# EAGLE design qo-100-psu-interface (EAGLE 9.6.2)
CREVISION: 1; DESIGNER: Joao Silva
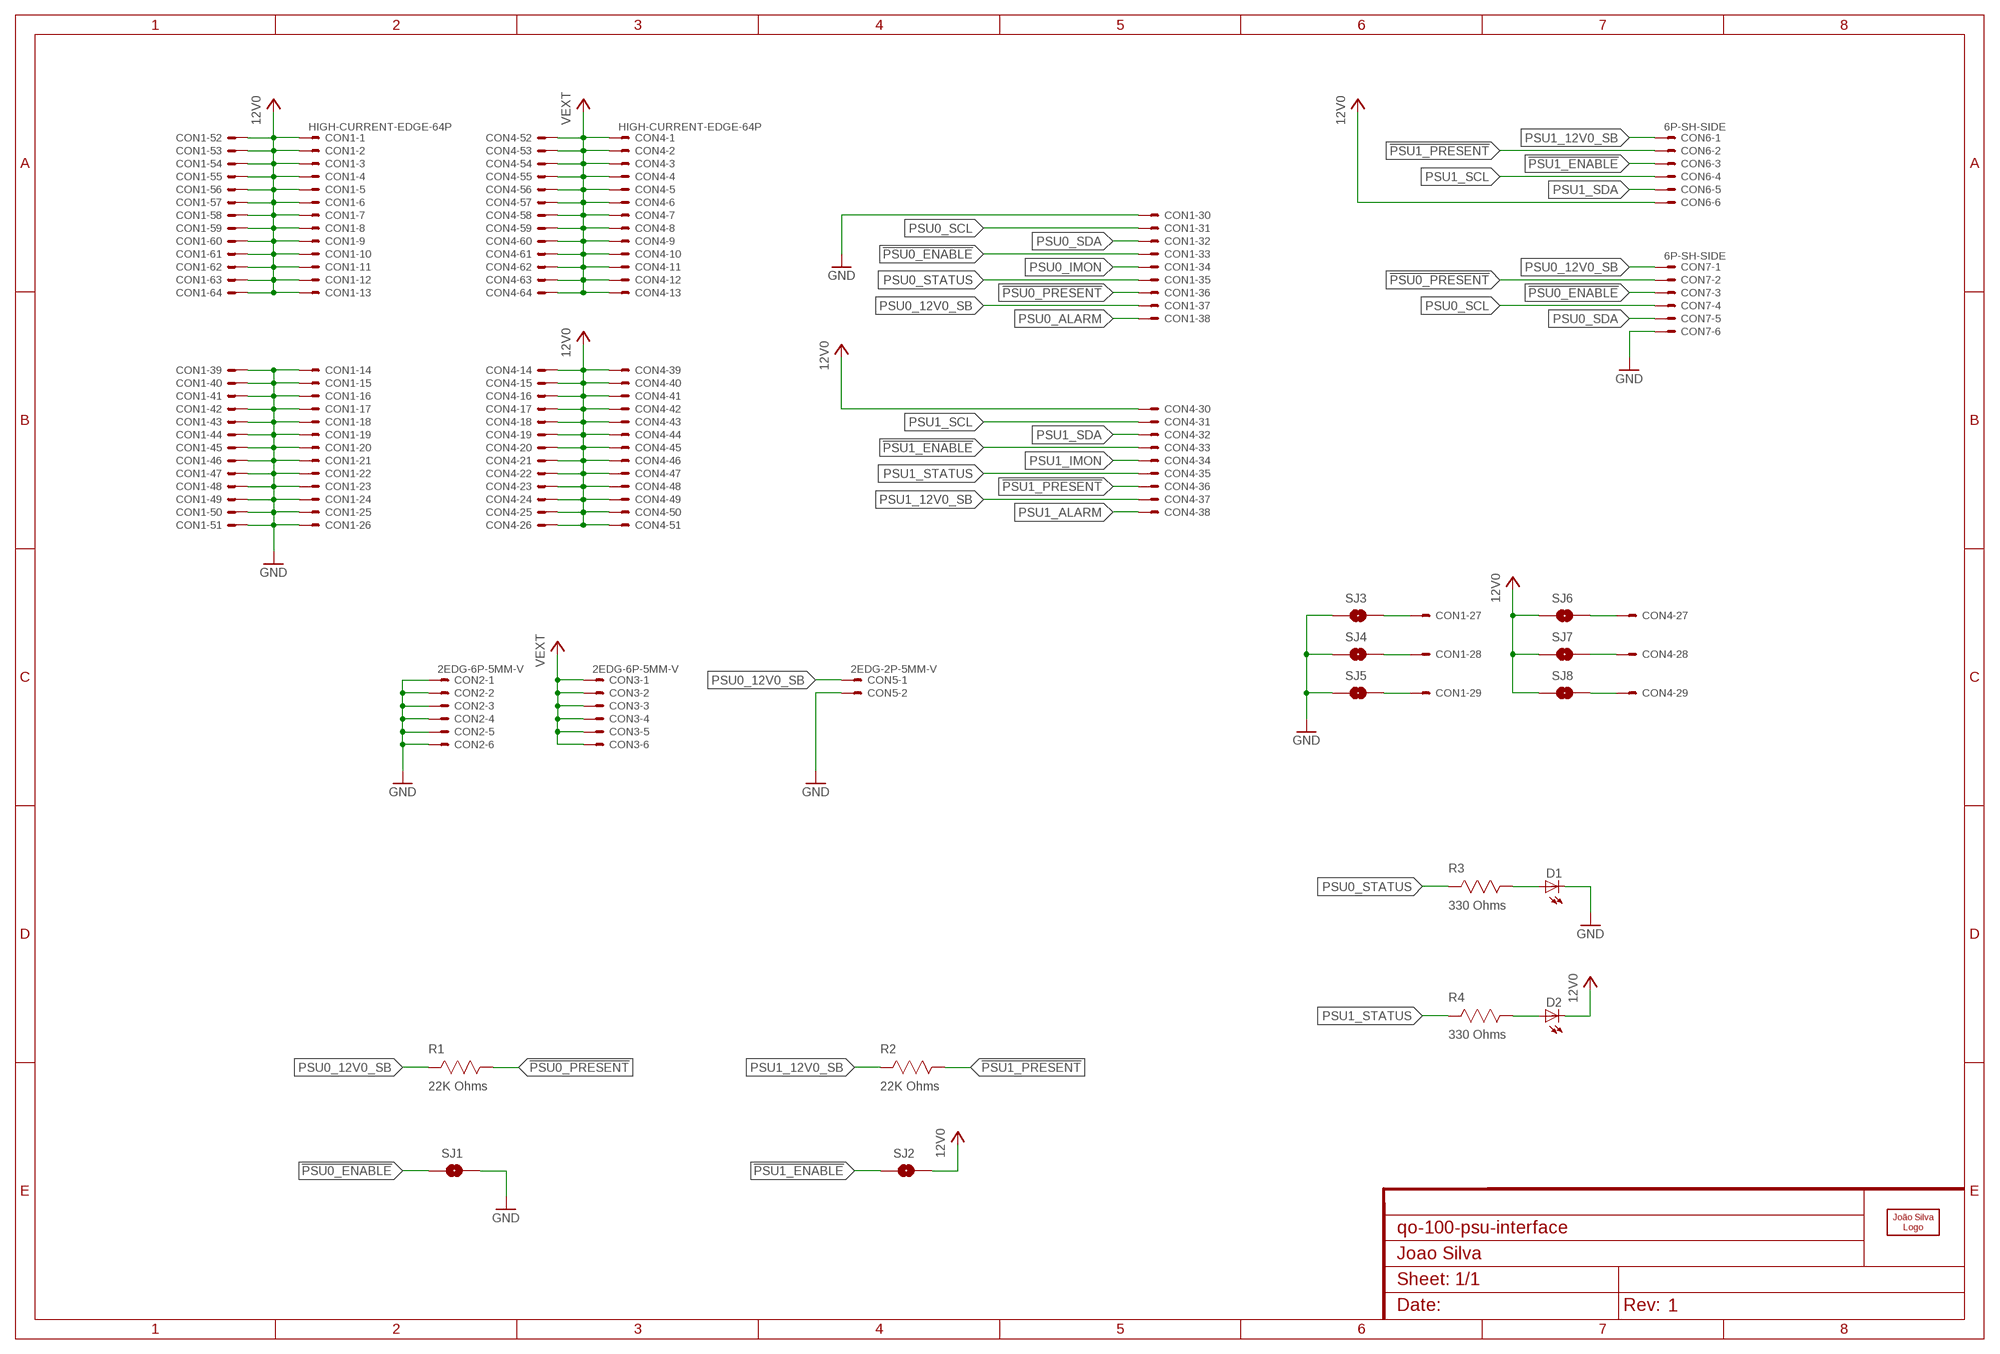
[diagram p0: schematic, sheet 1]

## Parts
CON1  HIGH-CURRENT-EDGE-64P  [HIGH-CURRENT-EDGE-64P]
CON2  2EDG-6P-5MM-V  [2EDG-6P-5MM-V]
CON3  2EDG-6P-5MM-V  [2EDG-6P-5MM-V]
CON4  HIGH-CURRENT-EDGE-64P  [HIGH-CURRENT-EDGE-64P]
CON5  2EDG-2P-5MM-V  [2EDG-2P-5MM-V]
CON6  6P-SH-SIDE  [SH-06-SIDE]
CON7  6P-SH-SIDE  [SH-06-SIDE]
D1  LED0603  [0603]
D2  LED0603  [0603]
LOGO1  JS-5MM  [JS_5MM]
R1  22K Ohms  RESISTOR-0603  [RES0603]
R2  22K Ohms  RESISTOR-0603  [RES0603]
R3  330 Ohms  RESISTOR-0603  [RES0603]
R4  330 Ohms  RESISTOR-0603  [RES0603]
SJ1  SJS  [SJ_S]
SJ2  SJS  [SJ_S]
SJ3  SJS  [SJ_S]
SJ4  SJS  [SJ_S]
SJ5  SJS  [SJ_S]
SJ6  SJS  [SJ_S]
SJ7  SJS  [SJ_S]
SJ8  SJS  [SJ_S]

## Nets
12V0: CON1.1 CON1.2 CON1.3 CON1.4 CON1.5 CON1.6 CON1.7 CON1.8 CON1.9 CON1.10 CON1.11 CON1.12 CON1.13 CON1.52 CON1.53 CON1.54 CON1.55 CON1.56 CON1.57 CON1.58 CON1.59 CON1.60 CON1.61 CON1.62 CON1.63 CON1.64 CON4.14 CON4.15 CON4.16 CON4.17 CON4.18 CON4.19 CON4.20 CON4.21 CON4.22 CON4.23 CON4.24 CON4.25 CON4.26 CON4.30 CON4.39 CON4.40 CON4.41 CON4.42 CON4.43 CON4.44 CON4.45 CON4.46 CON4.47 CON4.48 CON4.49 CON4.50 CON4.51 CON6.6 D2.C SJ2.2 SJ6.1 SJ7.1 SJ8.1
!PSU0_ENABLE: CON1.33 CON7.3 SJ1.1
!PSU0_PRESENT: CON1.36 CON7.2 R1.1
!PSU1_ENABLE: CON4.33 CON6.3 SJ2.1
!PSU1_PRESENT: CON4.36 CON6.2 R2.1
GND: CON1.14 CON1.15 CON1.16 CON1.17 CON1.18 CON1.19 CON1.20 CON1.21 CON1.22 CON1.23 CON1.24 CON1.25 CON1.26 CON1.30 CON1.39 CON1.40 CON1.41 CON1.42 CON1.43 CON1.44 CON1.45 CON1.46 CON1.47 CON1.48 CON1.49 CON1.50 CON1.51 CON2.P$1 CON2.P$2 CON2.P$3 CON2.P$4 CON2.P$5 CON2.P$6 CON5.P$2 CON7.6 D1.C SJ1.2 SJ3.1 SJ4.1 SJ5.1
N$1: CON1.29 SJ5.2
N$2: CON1.28 SJ4.2
N$3: CON1.27 SJ3.2
N$4: CON4.27 SJ6.2
N$5: CON4.28 SJ7.2
N$6: CON4.29 SJ8.2
N$7: D1.A R3.1
N$8: D2.A R4.1
PSU0_12V0_SB: CON1.37 CON5.P$1 CON7.1 R1.2
PSU0_ALARM: CON1.38
PSU0_IMON: CON1.34
PSU0_SCL: CON1.31 CON7.4
PSU0_SDA: CON1.32 CON7.5
PSU0_STATUS: CON1.35 R3.2
PSU1_12V0_SB: CON4.37 CON6.1 R2.2
PSU1_ALARM: CON4.38
PSU1_IMON: CON4.34
PSU1_SCL: CON4.31 CON6.4
PSU1_SDA: CON4.32 CON6.5
PSU1_STATUS: CON4.35 R4.2
VEXT: CON3.P$1 CON3.P$2 CON3.P$3 CON3.P$4 CON3.P$5 CON3.P$6 CON4.1 CON4.2 CON4.3 CON4.4 CON4.5 CON4.6 CON4.7 CON4.8 CON4.9 CON4.10 CON4.11 CON4.12 CON4.13 CON4.52 CON4.53 CON4.54 CON4.55 CON4.56 CON4.57 CON4.58 CON4.59 CON4.60 CON4.61 CON4.62 CON4.63 CON4.64

## Library data of the parts
CON1 CON4 = Generic Connector:HIGH-CURRENT-EDGE-64P
CON2 CON3 = Generic Connector:2EDG-6P
CON5 = Generic Connector:2EDG-2P
CON6 CON7 = JST:6P: Disconnectable Crimp style connector, 1.0mm pitch 6 contacts
D1 D2 = LED:LED
LOGO1 = Silkscreen:JS
R1-R4 = Resistor:RESISTOR
SJ1-SJ8 = Solder Jumper:SJ

## Board
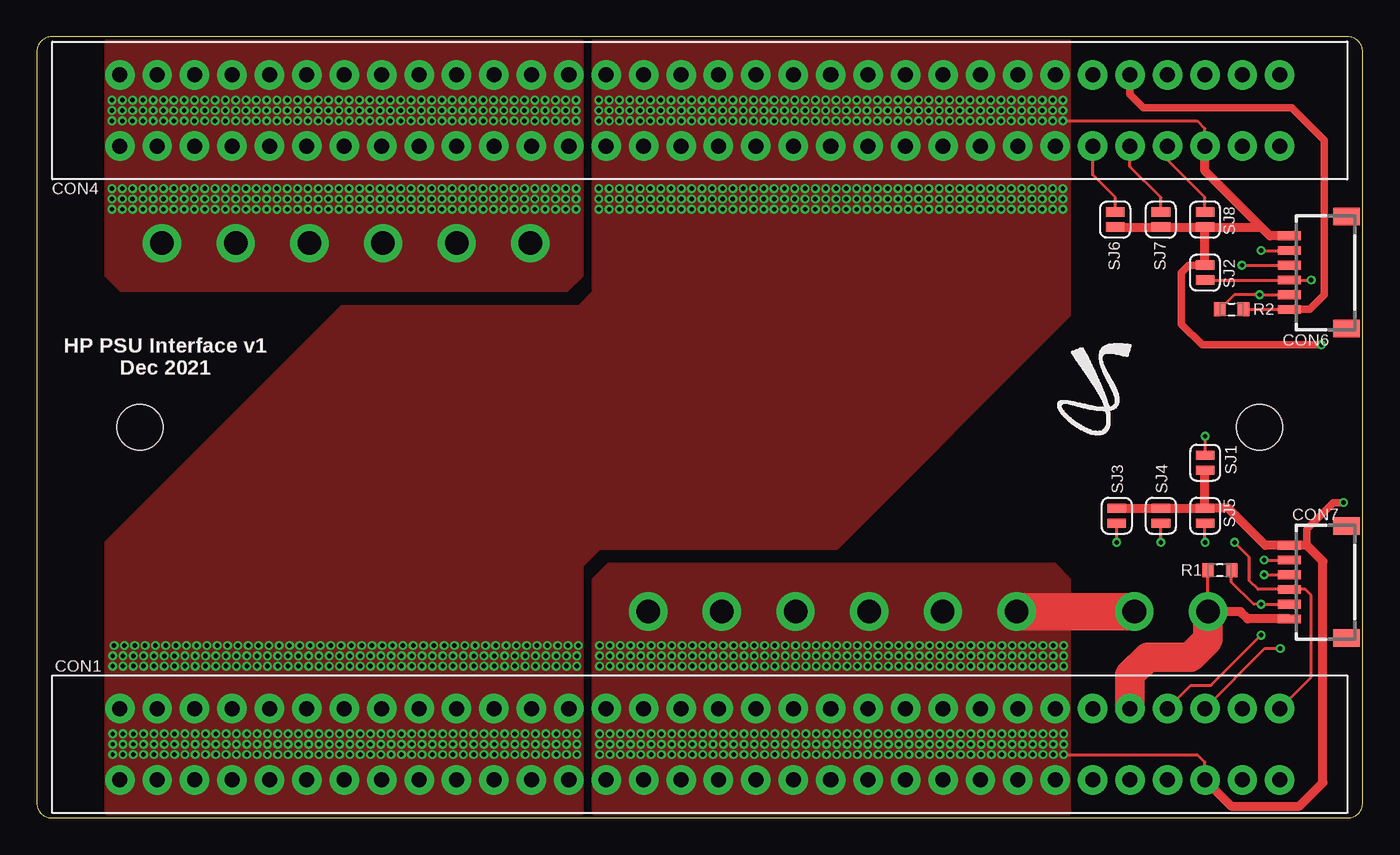
[diagram p1: board, top side]
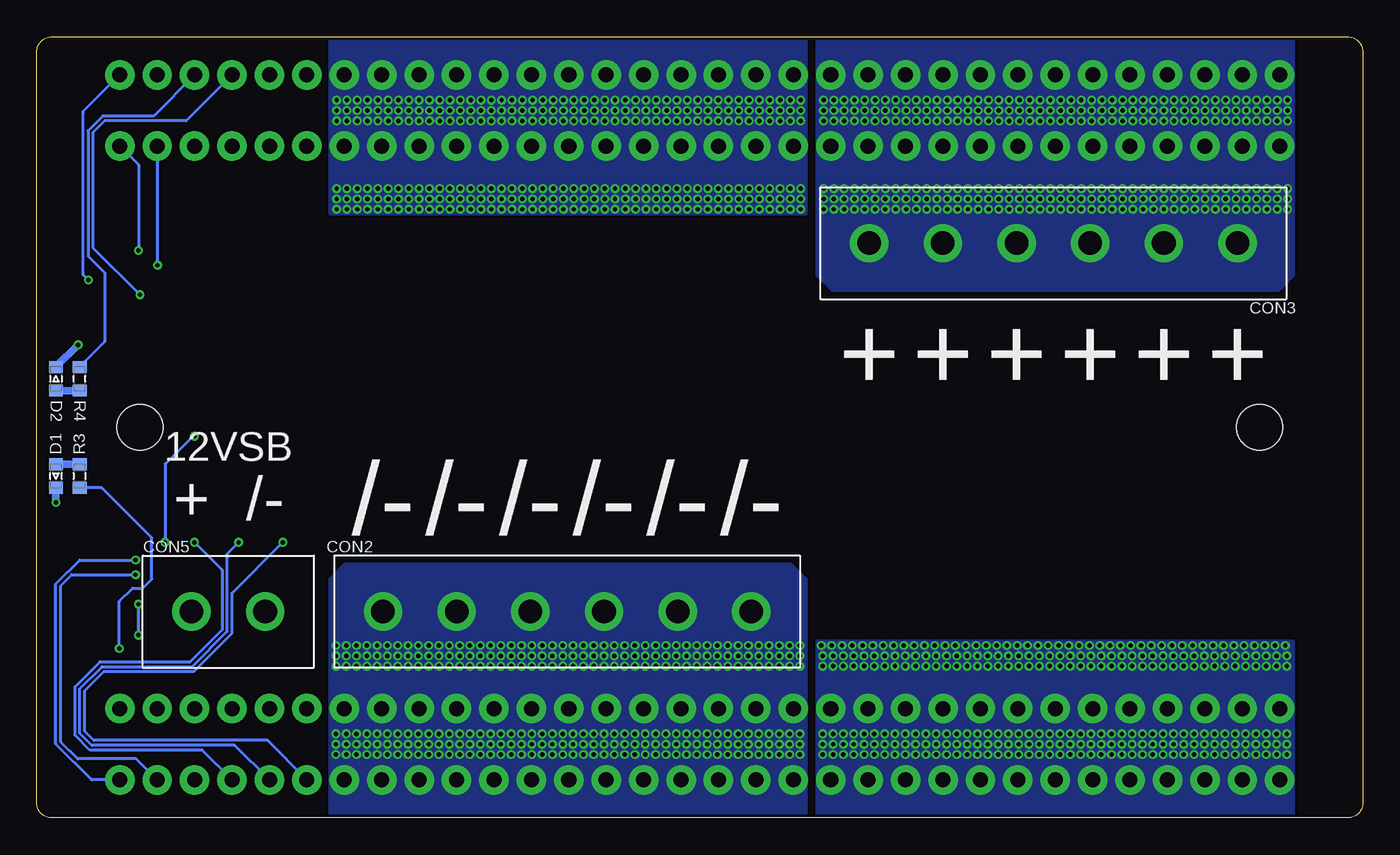
[diagram p2: board, bottom side, seen from below]

Size 90 x 53 mm. Coordinates in mm from the lower left corner, seen from the top.
Outline: 89,53 1,53 arc90 0,52 0,1 arc90 1,0 89,0 arc90 90,1 90,52 arc90 89,53
Copper layers (1*16): Top 0.035mm / dielectric 1.6mm / Bottom 0.035mm
Design rules "jlcpcb_2layer": minimum track width 5mil, minimum drill 0.3mm, track to track 5mil, track to pad 5mil, pad to pad 5mil, via to via 5mil, smd to smd 5mil, copper to edge 0.2mm, drill to drill 5mil, minimum pad ring 0.13mm, minimum via ring 0.1mm, stop-mask expansion 0.04mm, vias tented up to drill 10mm, thermal gap 5mil
Holes 3.1 mm at 7,26.5 83,26.5

### Footprints (pad centres in the part's own frame; a part is rotated, then mirrored left to right if it is on the bottom)
HIGH-CURRENT-EDGE-64P = drill 1.02 pad 2: 1 -39.37,-2.42; 2 -36.83,-2.42; 3 -34.29,-2.42; 4 -31.75,-2.42; 5 -29.21,-2.42; 6 -26.67,-2.42; 7 -24.13,-2.42; 8 -21.59,-2.42; 9 -19.05,-2.42; 10 -16.51,-2.42; 11 -13.97,-2.42; 12 -11.43,-2.42; 13 -8.89,-2.42; 14 -6.35,-2.42; 15 -3.81,-2.42; 16 -1.27,-2.42; 17 1.27,-2.42; 18 3.81,-2.42; 19 6.35,-2.42; 20 8.89,-2.42; 21 11.43,-2.42; 22 13.97,-2.42; 23 16.51,-2.42; 24 19.05,-2.42; 25 21.59,-2.42; 26 24.13,-2.42; 27 26.67,-2.42; 28 29.21,-2.42; 29 31.75,-2.42; 30 34.29,-2.42; 31 36.83,-2.42; 32 39.37,-2.42; 33 39.37,2.42; 34 36.83,2.42; 35 34.29,2.42; 36 31.75,2.42; 37 29.21,2.42; 38 26.67,2.42; 39 24.13,2.42; 40 21.59,2.42; 41 19.05,2.42; 42 16.51,2.42; 43 13.97,2.42; 44 11.43,2.42; 45 8.89,2.42; 46 6.35,2.42; 47 3.81,2.42; 48 1.27,2.42; 49 -1.27,2.42; 50 -3.81,2.42; 51 -6.35,2.42; 52 -8.89,2.42; 53 -11.43,2.42; 54 -13.97,2.42; 55 -16.51,2.42; 56 -19.05,2.42; 57 -21.59,2.42; 58 -24.13,2.42; 59 -26.67,2.42; 60 -29.21,2.42; 61 -31.75,2.42; 62 -34.29,2.42; 63 -36.83,2.42; 64 -39.37,2.42
2EDG-6P-5MM-V = drill 1.6 pad 2.6: P$1 -12.5,0; P$2 -7.5,0; P$3 -2.5,0; P$4 2.5,0; P$5 7.5,0; P$6 12.5,0
2EDG-2P-5MM-V = drill 1.6 pad 2.6: P$1 -2.5,0; P$2 2.5,0
SH-06-SIDE = smd 0.6 x 1.55: 1 -2.5,2.975; 2 -1.5,2.975; 3 -0.5,2.975; 4 0.5,2.975; 5 1.5,2.975; 6 2.5,2.975 | smd 1.2 x 1.8: FIT@1 -3.8,-0.9; FIT@2 3.8,-0.9
0603 = smd 0.8 x 0.95: A 0.8,0; C -0.8,0
RES0603 = smd 0.8 x 0.95: 1 -0.8,0; 2 0.8,0
SJ_S = smd 0.635 x 1.27: 1 -0.508,0; 2 0.508,0

### Placement (x,y rotation side)
CON1  45,5 0 top
CON2  54,14 180 bottom
CON3  21,39 0 bottom
CON4  45,48 0 top
CON5  77,14 0 bottom
CON6  88,37 90 top
CON7  88,16 90 top
D1  88.7,23.2 90 bottom
D2  88.7,29.8 270 bottom
LOGO1  74.5,32.4 0 top
R1  80.3,16.8 180 top
R2  81.1,34.5 0 top
R3  87.1,23.2 270 bottom
R4  87.1,29.8 90 bottom
SJ1  79.3,24.1 270 top
SJ2  79.3,37 90 top
SJ3  73.3,20.5 270 top
SJ4  76.3,20.5 270 top
SJ5  79.3,20.5 270 top
SJ6  73.2,40.6 90 top
SJ7  76.3,40.6 90 top
SJ8  79.3,40.6 90 top

### Tracks (layer width: path | path; a pad name or v marks a point on that pad's centre or on a via)
12V0  (via drill 0.3)
  Top 0.2: CON4.30 79.29,46.78 78.77,47.3 v69.65,47.3
  Top 0.508: v87.2,32.1 79.1,32.1 77.7,33.5 77.7,37 78.21,37.51 SJ2.2
  Top 0.61: SJ6.1 SJ7.1 SJ8.1 | SJ8.1 83.11,40.09 | 83.11,40.09 83.7,39.5 CON6.6 | 83.11,40.09 79.29,43.91 CON4.30 | SJ2.2 SJ8.1
  Bottom 0.508: D2.C v87.2,32.1
  other vias: 38.85,41.3 38.15,41.3 38.15,42 38.15,42.7 38.85,42.7 38.85,42 40.25,41.3 39.55,41.3 39.55,42 39.55,42.7 40.25,42.7 40.25,42 41.65,41.3 40.95,41.3 40.95,42 40.95,42.7 41.65,42.7 41.65,42 43.05,41.3 42.35,41.3 42.35,42 42.35,42.7 43.05,42.7 43.05,42 44.45,41.3 43.75,41.3 43.75,42 43.75,42.7 44.45,42.7 44.45,42 45.85,41.3 45.15,41.3 45.15,42 45.15,42.7 45.85,42.7 45.85,42 47.25,41.3 46.55,41.3 46.55,42 46.55,42.7 47.25,42.7 47.25,42 68.25,41.3 67.55,41.3 67.55,42 67.55,42.7 68.25,42.7 68.25,42 69.65,41.3 68.95,41.3 68.95,42 68.95,42.7 69.65,42.7 69.65,42 58.45,41.3 57.75,41.3 57.75,42 57.75,42.7 58.45,42.7 58.45,42 59.85,41.3 59.15,41.3 59.15,42 59.15,42.7 59.85,42.7 59.85,42 61.25,41.3 60.55,41.3 60.55,42 60.55,42.7 61.25,42.7 61.25,42 62.65,41.3 61.95,41.3 61.95,42 61.95,42.7 62.65,42.7 62.65,42 64.05,41.3 63.35,41.3 63.35,42 63.35,42.7 64.05,42.7 64.05,42 65.45,41.3 64.75,41.3 64.75,42 64.75,42.7 65.45,42.7 65.45,42 66.85,41.3 66.15,41.3 66.15,42 66.15,42.7 66.85,42.7 66.85,42 48.65,41.3 47.95,41.3 47.95,42 47.95,42.7 48.65,42.7 48.65,42 50.05,41.3 49.35,41.3 49.35,42 49.35,42.7 50.05,42.7 50.05,42 51.45,41.3 50.75,41.3 50.75,42 50.75,42.7 51.45,42.7 51.45,42 52.85,41.3 52.15,41.3 52.15,42 52.15,42.7 52.85,42.7 52.85,42 54.25,41.3 53.55,41.3 53.55,42 53.55,42.7 54.25,42.7 54.25,42 55.65,41.3 54.95,41.3 54.95,42 54.95,42.7 55.65,42.7 55.65,42 57.05,41.3 56.35,41.3 56.35,42 56.35,42.7 57.05,42.7 57.05,42 5.85,10.3 5.15,10.3 5.15,11 5.25,11.7 5.95,11.7 5.85,11 7.25,10.3 6.55,10.3 6.55,11 6.65,11.7 7.35,11.7 7.25,11 8.65,10.3 7.95,10.3 7.95,11 8.05,11.7 8.75,11.7 8.65,11 10.05,10.3 9.35,10.3 9.35,11 9.45,11.7 10.15,11.7 10.05,11 11.45,10.3 10.75,10.3 10.75,11 10.85,11.7 11.55,11.7 11.45,11 12.85,10.3 12.15,10.3 12.15,11 12.25,11.7 12.95,11.7 12.85,11 14.25,10.3 13.55,10.3 13.55,11 13.65,11.7 14.35,11.7 14.25,11 35.25,10.3 34.55,10.3 34.55,11 34.65,11.7 35.35,11.7 35.25,11 36.65,10.3 35.95,10.3 35.95,11 36.05,11.7 36.75,11.7 36.65,11 25.45,10.3 24.75,10.3 24.75,11 24.85,11.7 25.55,11.7 25.45,11 26.85,10.3 26.15,10.3 26.15,11 26.25,11.7 26.95,11.7 26.85,11 28.25,10.3 27.55,10.3 27.55,11 27.65,11.7 28.35,11.7 28.25,11 29.65,10.3 28.95,10.3 28.95,11 29.05,11.7 29.75,11.7 29.65,11 31.05,10.3 30.35,10.3 30.35,11 30.45,11.7 31.15,11.7 31.05,11 32.45,10.3 31.75,10.3 31.75,11 31.85,11.7 32.55,11.7 32.45,11 33.85,10.3 33.15,10.3 33.15,11 33.25,11.7 33.95,11.7 33.85,11 15.65,10.3 14.95,10.3 14.95,11 15.05,11.7 15.75,11.7 15.65,11 17.05,10.3 16.35,10.3 16.35,11 16.45,11.7 17.15,11.7 17.05,11 18.45,10.3 17.75,10.3 17.75,11 17.85,11.7 18.55,11.7 18.45,11 19.85,10.3 19.15,10.3 19.15,11 19.25,11.7 19.95,11.7 19.85,11 21.25,10.3 20.55,10.3 20.55,11 20.65,11.7 21.35,11.7 21.25,11 22.65,10.3 21.95,10.3 21.95,11 22.05,11.7 22.75,11.7 22.65,11 24.05,10.3 23.35,10.3 23.35,11 23.45,11.7 24.15,11.7 24.05,11 5.85,4.3 5.15,4.3 5.15,5 5.15,5.7 5.85,5.7 5.85,5 7.25,4.3 6.55,4.3 6.55,5 6.55,5.7 7.25,5.7 7.25,5 8.65,4.3 7.95,4.3 7.95,5 7.95,5.7 8.65,5.7 8.65,5 10.05,4.3 9.35,4.3 9.35,5 9.35,5.7 10.05,5.7 10.05,5 11.45,4.3 10.75,4.3 10.75,5 10.75,5.7 11.45,5.7 11.45,5 12.85,4.3 12.15,4.3 12.15,5 12.15,5.7 12.85,5.7 12.85,5 14.25,4.3 13.55,4.3 13.55,5 13.55,5.7 14.25,5.7 14.25,5 35.25,4.3 34.55,4.3 34.55,5 34.55,5.7 35.25,5.7 35.25,5 36.65,4.3 35.95,4.3 35.95,5 35.95,5.7 36.65,5.7 36.65,5 25.45,4.3 24.75,4.3 24.75,5 24.75,5.7 25.45,5.7 25.45,5 26.85,4.3 26.15,4.3 26.15,5 26.15,5.7 26.85,5.7 26.85,5 28.25,4.3 27.55,4.3 27.55,5 27.55,5.7 28.25,5.7 28.25,5 29.65,4.3 28.95,4.3 28.95,5 28.95,5.7 29.65,5.7 29.65,5 31.05,4.3 30.35,4.3 30.35,5 30.35,5.7 31.05,5.7 31.05,5 32.45,4.3 31.75,4.3 31.75,5 31.75,5.7 32.45,5.7 32.45,5 33.85,4.3 33.15,4.3 33.15,5 33.15,5.7 33.85,5.7 33.85,5 15.65,4.3 14.95,4.3 14.95,5 14.95,5.7 15.65,5.7 15.65,5 17.05,4.3 16.35,4.3 16.35,5 16.35,5.7 17.05,5.7 17.05,5 18.45,4.3 17.75,4.3 17.75,5 17.75,5.7 18.45,5.7 18.45,5 19.85,4.3 19.15,4.3 19.15,5 19.15,5.7 19.85,5.7 19.85,5 21.25,4.3 20.55,4.3 20.55,5 20.55,5.7 21.25,5.7 21.25,5 22.65,4.3 21.95,4.3 21.95,5 21.95,5.7 22.65,5.7 22.65,5 24.05,4.3 23.35,4.3 23.35,5 23.35,5.7 24.05,5.7 24.05,5 38.85,47.3 38.15,47.3 38.15,48 38.15,48.7 38.85,48.7 38.85,48 40.25,47.3 39.55,47.3 39.55,48 39.55,48.7 40.25,48.7 40.25,48 41.65,47.3 40.95,47.3 40.95,48 40.95,48.7 41.65,48.7 41.65,48 43.05,47.3 42.35,47.3 42.35,48 42.35,48.7 43.05,48.7 43.05,48 44.45,47.3 43.75,47.3 43.75,48 43.75,48.7 44.45,48.7 44.45,48 45.85,47.3 45.15,47.3 45.15,48 45.15,48.7 45.85,48.7 45.85,48 47.25,47.3 46.55,47.3 46.55,48 46.55,48.7 47.25,48.7 47.25,48 68.25,47.3 67.55,47.3 67.55,48 67.55,48.7 68.25,48.7 68.25,48 68.95,47.3 68.95,48 68.95,48.7 69.65,48.7 69.65,48 58.45,47.3 57.75,47.3 57.75,48 57.75,48.7 58.45,48.7 58.45,48 59.85,47.3 59.15,47.3 59.15,48 59.15,48.7 59.85,48.7 59.85,48 61.25,47.3 60.55,47.3 60.55,48 60.55,48.7 61.25,48.7 61.25,48 62.65,47.3 61.95,47.3 61.95,48 61.95,48.7 62.65,48.7 62.65,48 64.05,47.3 63.35,47.3 63.35,48 63.35,48.7 64.05,48.7 64.05,48 65.45,47.3 64.75,47.3 64.75,48 64.75,48.7 65.45,48.7 65.45,48 66.85,47.3 66.15,47.3 66.15,48 66.15,48.7 66.85,48.7 66.85,48 48.65,47.3 47.95,47.3 47.95,48 47.95,48.7 48.65,48.7 48.65,48 50.05,47.3 49.35,47.3 49.35,48 49.35,48.7 50.05,48.7 50.05,48 51.45,47.3 50.75,47.3 50.75,48 50.75,48.7 51.45,48.7 51.45,48 52.85,47.3 52.15,47.3 52.15,48 52.15,48.7 52.85,48.7 52.85,48 54.25,47.3 53.55,47.3 53.55,48 53.55,48.7 54.25,48.7 54.25,48 55.65,47.3 54.95,47.3 54.95,48 54.95,48.7 55.65,48.7 55.65,48 57.05,47.3 56.35,47.3 56.35,48 56.35,48.7 57.05,48.7 57.05,48
  pour Top (no thermals): 4.7,0.3 4.7,18.7 20.7,34.7 36.8,34.7 37.8,35.7 37.8,52.7 70.1,52.7 70.1,34.1 54.3,18.3 38.2,18.3 37,17.1 37,0.3
  pour Bottom (no thermals): 37.8,52.7 70.1,52.7 70.1,41 37.8,41
  pour Bottom (no thermals): 37,0.3 4.7,0.3 4.7,12 37,12
!PSU0_ENABLE  (via drill 0.3)
  Top 0.2: CON1.33 86.5,9.55 86.5,15.1 86.1,15.5 CON7.3 82.9,15.5 82.3,16.1 82.3,17.7 v81.3,18.7 | v79.3,25.9 SJ1.1
  Bottom 0.2: v79.3,25.9 79.4,25.9 81.3,24 v81.3,18.7
!PSU0_PRESENT  (via drill 0.3)
  Top 0.2: CON1.36 78.33,9 79.7,9 v83.1,12.4 | CON7.2 v83.1,14.5 82.6,14.5 81.1,16 R1.1
  Bottom 0.2: v83.1,12.4 v83.1,14.5
!PSU1_ENABLE  (via drill 0.3)
  Top 0.2: v86.5,36.5 CON6.3 SJ2.1
  Bottom 0.2: CON4.33 86.85,47.94 86.85,36.85 v86.5,36.5
!PSU1_PRESENT  (via drill 0.3)
  Top 0.2: CON6.2 v83,35.5 81.3,35.5 R2.1
  Bottom 0.2: CON4.36 79.87,47.3 85.4,47.3 86.2,46.5 86.2,38.7 v83,35.5
GND  (via drill 0.3)
  Top 0.2: CON1.30 79.29,3.78 78.77,4.3 v69.7,4.3
  Top 0.508: v88.7,21.4 88,21.4 86.2,19.6 86.2,18.5
  Top 0.61: 66.4,14.1 CON2.P$6 | SJ3.1 SJ4.1 SJ5.1 | SJ5.1 SJ1.2 | SJ5.1 80.89,21.01 83.4,18.5 CON7.6 86.2,18.5 87.3,17.4 87.3,2.4 85.7,0.8 81.07,0.8 CON1.30
  Top 2.54: CON5.P$2 CON2.P$6
  Bottom 0.508: D1.C v88.7,21.4
  other vias: 69,5.7 69.7,5.7 69.7,5 69,4.3 69,5 67.6,5.7 68.3,5.7 68.3,5 68.3,4.3 67.6,4.3 67.6,5 66.2,5.7 66.9,5.7 66.9,5 66.9,4.3 66.2,4.3 66.2,5 64.8,5.7 65.5,5.7 65.5,5 65.5,4.3 64.8,4.3 64.8,5 63.4,5.7 64.1,5.7 64.1,5 64.1,4.3 63.4,4.3 63.4,5 62,5.7 62.7,5.7 62.7,5 62.7,4.3 62,4.3 62,5 60.6,5.7 61.3,5.7 61.3,5 61.3,4.3 60.6,4.3 60.6,5 39.6,5.7 40.3,5.7 40.3,5 40.3,4.3 39.6,4.3 39.6,5 38.2,5.7 38.9,5.7 38.9,5 38.9,4.3 38.2,4.3 38.2,5 49.4,5.7 50.1,5.7 50.1,5 50.1,4.3 49.4,4.3 49.4,5 48,5.7 48.7,5.7 48.7,5 48.7,4.3 48,4.3 48,5 46.6,5.7 47.3,5.7 47.3,5 47.3,4.3 46.6,4.3 46.6,5 45.2,5.7 45.9,5.7 45.9,5 45.9,4.3 45.2,4.3 45.2,5 43.8,5.7 44.5,5.7 44.5,5 44.5,4.3 43.8,4.3 43.8,5 42.4,5.7 43.1,5.7 43.1,5 43.1,4.3 42.4,4.3 42.4,5 41,5.7 41.7,5.7 41.7,5 41.7,4.3 41,4.3 41,5 59.2,5.7 59.9,5.7 59.9,5 59.9,4.3 59.2,4.3 59.2,5 57.8,5.7 58.5,5.7 58.5,5 58.5,4.3 57.8,4.3 57.8,5 56.4,5.7 57.1,5.7 57.1,5 57.1,4.3 56.4,4.3 56.4,5 55,5.7 55.7,5.7 55.7,5 55.7,4.3 55,4.3 55,5 53.6,5.7 54.3,5.7 54.3,5 54.3,4.3 53.6,4.3 53.6,5 52.2,5.7 52.9,5.7 52.9,5 52.9,4.3 52.2,4.3 52.2,5 50.8,5.7 51.5,5.7 51.5,5 51.5,4.3 50.8,4.3 50.8,5 69,11.7 69.7,11.7 69.7,11 69.7,10.3 69,10.3 69,11 67.6,11.7 68.3,11.7 68.3,11 68.3,10.3 67.6,10.3 67.6,11 66.2,11.7 66.9,11.7 66.9,11 66.9,10.3 66.2,10.3 66.2,11 64.8,11.7 65.5,11.7 65.5,11 65.5,10.3 64.8,10.3 64.8,11 63.4,11.7 64.1,11.7 64.1,11 64.1,10.3 63.4,10.3 63.4,11 62,11.7 62.7,11.7 62.7,11 62.7,10.3 62,10.3 62,11 60.6,11.7 61.3,11.7 61.3,11 61.3,10.3 60.6,10.3 60.6,11 39.6,11.7 40.3,11.7 40.3,11 40.3,10.3 39.6,10.3 39.6,11 38.2,11.7 38.9,11.7 38.9,11 38.9,10.3 38.2,10.3 38.2,11 49.4,11.7 50.1,11.7 50.1,11 50.1,10.3 49.4,10.3 49.4,11 48,11.7 48.7,11.7 48.7,11 48.7,10.3 48,10.3 48,11 46.6,11.7 47.3,11.7 47.3,11 47.3,10.3 46.6,10.3 46.6,11 45.2,11.7 45.9,11.7 45.9,11 45.9,10.3 45.2,10.3 45.2,11 43.8,11.7 44.5,11.7 44.5,11 44.5,10.3 43.8,10.3 43.8,11 42.4,11.7 43.1,11.7 43.1,11 43.1,10.3 42.4,10.3 42.4,11 41,11.7 41.7,11.7 41.7,11 41.7,10.3 41,10.3 41,11 59.2,11.7 59.9,11.7 59.9,11 59.9,10.3 59.2,10.3 59.2,11 57.8,11.7 58.5,11.7 58.5,11 58.5,10.3 57.8,10.3 57.8,11 56.4,11.7 57.1,11.7 57.1,11 57.1,10.3 56.4,10.3 56.4,11 55,11.7 55.7,11.7 55.7,11 55.7,10.3 55,10.3 55,11 53.6,11.7 54.3,11.7 54.3,11 54.3,10.3 53.6,10.3 53.6,11 52.2,11.7 52.9,11.7 52.9,11 52.9,10.3 52.2,10.3 52.2,11 50.8,11.7 51.5,11.7 51.5,11 51.5,10.3 50.8,10.3 50.8,11
  pour Top (no thermals): 70.1,0.3 37.8,0.3 37.8,16.2 38.8,17.2 69.1,17.2 70.1,16.2
  pour Bottom (no thermals): 70.1,0.3 37.8,0.3 37.8,16.2 38.8,17.2 69.1,17.2 70.1,16.2
N$1  (via drill 0.3)
  Top 0.2: v79.3,18.7 SJ5.2
  Bottom 0.2: CON1.29 78.77,4.6 83.3,4.6 83.5,4.6 86.4,4.6 87.4,5.6 87.4,8.9 85.7,10.6 79.6,10.6 77.4,12.8 77.4,16.8 v79.3,18.7
N$2  (via drill 0.3)
  Top 0.2: v76.3,18.7 SJ4.2
  Bottom 0.2: CON1.28 76.56,4.93 86.27,4.93 87.07,5.74 87.07,8.77 85.56,10.27 79.47,10.27 77.07,12.66 77.07,17.93 v76.3,18.7
N$3  (via drill 0.3)
  Top 0.2: v73.3,18.7 SJ3.2
  Bottom 0.2: CON1.27 74.34,5.25 86.13,5.25 86.75,5.87 86.75,8.63 85.43,9.95 79.33,9.95 76.75,12.53 76.75,15.25 v73.3,18.7
N$4
  Top 0.2: SJ6.2 73.2,42.1 71.67,43.63 CON4.27
N$5
  Top 0.2: SJ7.2 76.3,42.1 74.21,44.19 CON4.28
N$6
  Top 0.2: SJ8.2 79.3,42.1 76.75,44.65 CON4.29
N$7
  Bottom 0.508: D1.A R3.1
N$8
  Bottom 0.508: R4.1 D2.A
PSU0_12V0_SB
  Top 0.2: CON5.P$1 R1.2
  Top 0.61: CON7.1 82.2,13.5 81.7,14 CON5.P$1
  Top 2: CON1.37 74.21,9.71 75.4,10.9 78.3,10.9 79.5,12.1 CON5.P$1
PSU0_SCL  (via drill 0.3)
  Top 0.2: v83.3,16.5 CON7.4
  Bottom 0.2: CON1.31 83.25,4 87.24,4 88.37,5.13 88.37,15.77 87.64,16.5 v83.3,16.5
PSU0_SDA  (via drill 0.3)
  Top 0.2: v83.3,17.5 CON7.5
  Bottom 0.2: CON1.32 86.28,2.58 88.7,5 88.7,15.9 87.1,17.5 v83.3,17.5
PSU0_STATUS  (via drill 0.3)
  Top 0.2: CON1.35 83.37,11.5 v84.4,11.5
  Bottom 0.2: v84.4,11.5 84.4,14.7 83.5,15.6 82.8,15.6 82.2,16.2 82.2,19 85.6,22.4 R3.2
PSU1_12V0_SB
  Top 0.2: R2.2 85.4,34.5
  Top 0.508: CON4.37 74.21,49.09 75.1,48.2 85.2,48.2 87.4,46 87.4,35.5 86.4,34.5 85.4,34.5 CON6.1
PSU1_SCL  (via drill 0.3)
  Top 0.2: v81.8,37.5 CON6.4
  Bottom 0.2: CON4.31 81.83,37.53 v81.8,37.5
PSU1_SDA  (via drill 0.3)
  Top 0.2: v83.1,38.5 CON6.5
  Bottom 0.2: CON4.32 83.1,44.31 v83.1,38.5
PSU1_STATUS
  Bottom 0.2: CON4.35 82.08,47.63 85.53,47.63 86.53,46.63 86.53,38.13 85.4,37 85.4,32.3 R4.2
VEXT  (via drill 0.3)
  other vias: 5.8,47.3 5.1,47.3 5.1,48 5.1,48.7 5.8,48.7 5.8,48 7.2,47.3 6.5,47.3 6.5,48 6.5,48.7 7.2,48.7 7.2,48 8.6,47.3 7.9,47.3 7.9,48 7.9,48.7 8.6,48.7 8.6,48 10,47.3 9.3,47.3 9.3,48 9.3,48.7 10,48.7 10,48 11.4,47.3 10.7,47.3 10.7,48 10.7,48.7 11.4,48.7 11.4,48 12.8,47.3 12.1,47.3 12.1,48 12.1,48.7 12.8,48.7 12.8,48 14.2,47.3 13.5,47.3 13.5,48 13.5,48.7 14.2,48.7 14.2,48 35.2,47.3 34.5,47.3 34.5,48 34.5,48.7 35.2,48.7 35.2,48 36.6,47.3 35.9,47.3 35.9,48 35.9,48.7 36.6,48.7 36.6,48 25.4,47.3 24.7,47.3 24.7,48 24.7,48.7 25.4,48.7 25.4,48 26.8,47.3 26.1,47.3 26.1,48 26.1,48.7 26.8,48.7 26.8,48 28.2,47.3 27.5,47.3 27.5,48 27.5,48.7 28.2,48.7 28.2,48 29.6,47.3 28.9,47.3 28.9,48 28.9,48.7 29.6,48.7 29.6,48 31,47.3 30.3,47.3 30.3,48 30.3,48.7 31,48.7 31,48 32.4,47.3 31.7,47.3 31.7,48 31.7,48.7 32.4,48.7 32.4,48 33.8,47.3 33.1,47.3 33.1,48 33.1,48.7 33.8,48.7 33.8,48 15.6,47.3 14.9,47.3 14.9,48 14.9,48.7 15.6,48.7 15.6,48 17,47.3 16.3,47.3 16.3,48 16.3,48.7 17,48.7 17,48 18.4,47.3 17.7,47.3 17.7,48 17.7,48.7 18.4,48.7 18.4,48 19.8,47.3 19.1,47.3 19.1,48 19.1,48.7 19.8,48.7 19.8,48 21.2,47.3 20.5,47.3 20.5,48 20.5,48.7 21.2,48.7 21.2,48 22.6,47.3 21.9,47.3 21.9,48 21.9,48.7 22.6,48.7 22.6,48 24,47.3 23.3,47.3 23.3,48 23.3,48.7 24,48.7 24,48 5.8,41.3 5.1,41.3 5.1,42 5.1,42.7 5.8,42.7 5.8,42 7.2,41.3 6.5,41.3 6.5,42 6.5,42.7 7.2,42.7 7.2,42 8.6,41.3 7.9,41.3 7.9,42 7.9,42.7 8.6,42.7 8.6,42 10,41.3 9.3,41.3 9.3,42 9.3,42.7 10,42.7 10,42 11.4,41.3 10.7,41.3 10.7,42 10.7,42.7 11.4,42.7 11.4,42 12.8,41.3 12.1,41.3 12.1,42 12.1,42.7 12.8,42.7 12.8,42 14.2,41.3 13.5,41.3 13.5,42 13.5,42.7 14.2,42.7 14.2,42 35.2,41.3 34.5,41.3 34.5,42 34.5,42.7 35.2,42.7 35.2,42 36.6,41.3 35.9,41.3 35.9,42 35.9,42.7 36.6,42.7 36.6,42 25.4,41.3 24.7,41.3 24.7,42 24.7,42.7 25.4,42.7 25.4,42 26.8,41.3 26.1,41.3 26.1,42 26.1,42.7 26.8,42.7 26.8,42 28.2,41.3 27.5,41.3 27.5,42 27.5,42.7 28.2,42.7 28.2,42 29.6,41.3 28.9,41.3 28.9,42 28.9,42.7 29.6,42.7 29.6,42 31,41.3 30.3,41.3 30.3,42 30.3,42.7 31,42.7 31,42 32.4,41.3 31.7,41.3 31.7,42 31.7,42.7 32.4,42.7 32.4,42 33.8,41.3 33.1,41.3 33.1,42 33.1,42.7 33.8,42.7 33.8,42 15.6,41.3 14.9,41.3 14.9,42 14.9,42.7 15.6,42.7 15.6,42 17,41.3 16.3,41.3 16.3,42 16.3,42.7 17,42.7 17,42 18.4,41.3 17.7,41.3 17.7,42 17.7,42.7 18.4,42.7 18.4,42 19.8,41.3 19.1,41.3 19.1,42 19.1,42.7 19.8,42.7 19.8,42 21.2,41.3 20.5,41.3 20.5,42 20.5,42.7 21.2,42.7 21.2,42 22.6,41.3 21.9,41.3 21.9,42 21.9,42.7 22.6,42.7 22.6,42 24,41.3 23.3,41.3 23.3,42 23.3,42.7 24,42.7 24,42
  pour Top (no thermals): 4.7,52.7 37,52.7 37,36.8 36,35.8 5.7,35.8 4.7,36.8
  pour Bottom (no thermals): 4.7,52.7 37,52.7 37,36.8 36,35.8 5.7,35.8 4.7,36.8

### Text on the board
tPlace: HP PSU Interface v1 / Dec 2021
bPlace: + | + | + | + | + | + | 12VSB | -\ | -\ | -\ | -\ | -\ | -\ | -\ | +